# EAGLE schematic IRIS (EAGLE 6.1)
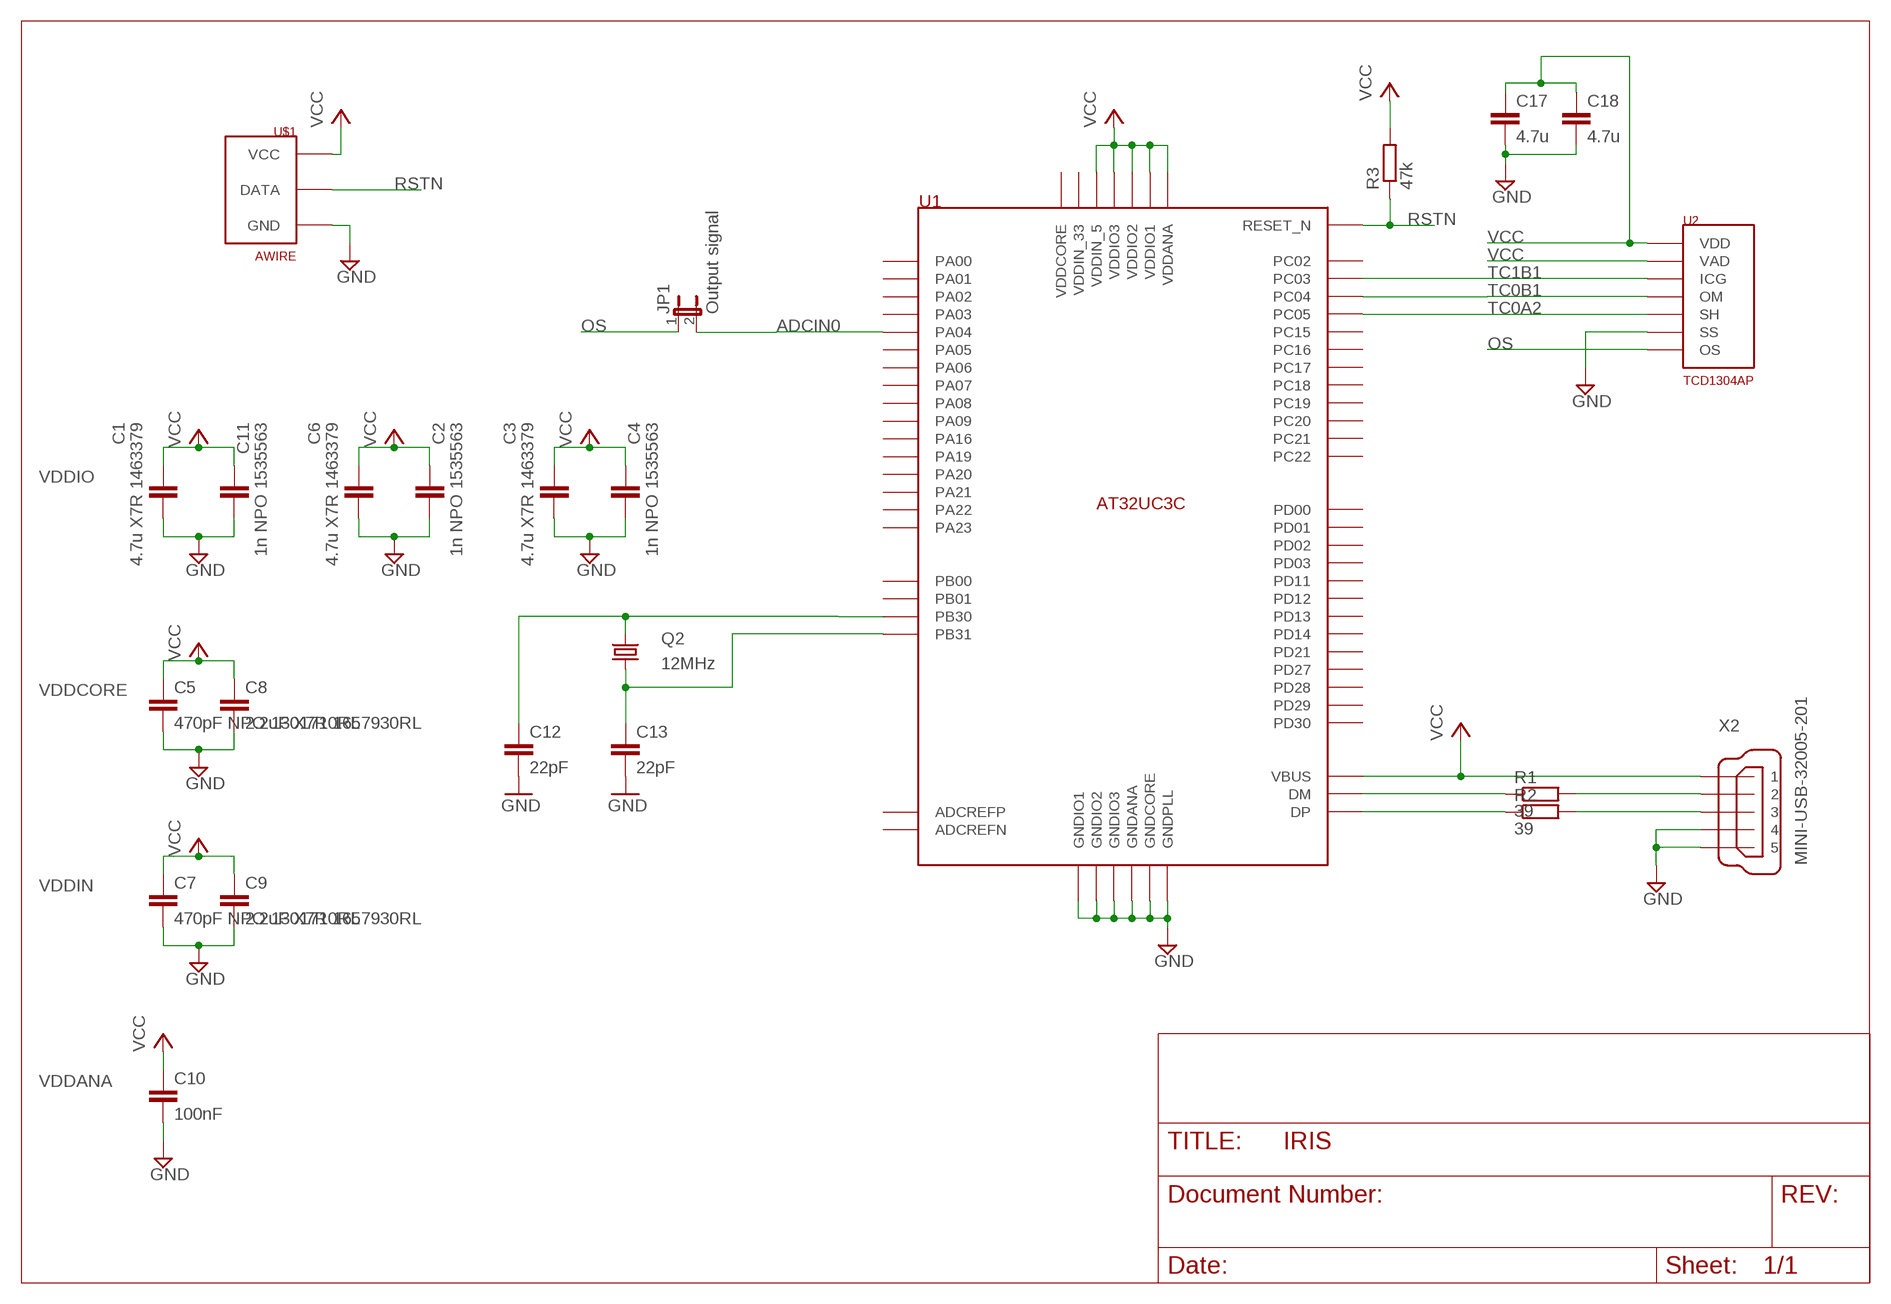
[diagram p0: schematic, sheet 1]

## Parts
C1  4.7u X7R 1463379  C-EUC0603  [C0603]
C2  1n NPO 1535563  C-EUC0402  [C0402]
C3  4.7u X7R 1463379  C-EUC0603  [C0603]
C4  1n NPO 1535563  C-EUC0402  [C0402]
C5  470pF NPO 1301710RL  C-EUC0603  [C0603]
C6  4.7u X7R 1463379  C-EUC0603  [C0603]
C7  470pF NPO 1301710RL  C-EUC0603  [C0603]
C8  2.2uF X7R 1657930RL  C-EUC0603  [C0603]
C9  2.2uF X7R 1657930RL  C-EUC0603  [C0603]
C10  100nF  C-EUC0603  [C0603]
C11  1n NPO 1535563  C-EUC0402  [C0402]
C12  22pF  C-EUC0402  [C0402]
C13  22pF  C-EUC0402  [C0402]
C17  4.7u  C-EUC0805  [C0805]
C18  4.7u  C-EUC0805  [C0805]
JP1  Output signal  JP1E  [JP1]
Q2  12MHz  CRYSTAL5X3  [CRYSTAL-SMD-5X3]
R1  39  R-EU_R0603  [R0603]
R2  39  R-EU_R0603  [R0603]
R3  47k  R-EU_R0603  [R0603]
U1  AT32UC3C  [TQFP64]
U2  TCD1304AP  [TCD1304AP]
U$1  AWIRE  [AWIRE]
X2  MINI-USB-32005-201  [32005-201]

## Nets
ADCIN0: JP1.2 U1.P$7(PA04)
GND: C1.2 C2.2 C3.2 C4.2 C5.2 C6.2 C7.2 C8.2 C9.2 C10.2 C11.2 C12.2 C13.2 C17.2 C18.2 U1.P$6(GNDIO1) U1.P$17(GNDANA) U1.P$26(GNDPLL) U1.P$30(GNDCORE) U1.P$36(GNDIO2) U1.P$52(GNDIO3) U2.P$22(SS) U$1.P$3(GND) X2.4 X2.5
N$1: R1.1 U1.P$24(DM)
N$2: R2.1 U1.P$25(DP)
N$3: R1.2 X2.2
N$4: R2.2 X2.3
N$21: C12.1 Q2.3 U1.P$31(PB30)
N$22: C13.1 Q2.1 U1.P$32(PB31)
OS: JP1.1 U2.P$21(OS)
RSTN: R3.1 U1.P$64(RESET_N) U$1.P$2(DATA)
TC0A2: U1.P$38(PC05) U2.P$5(SH)
TC0B1: U1.P$37(PC04) U2.P$4(OM)
TC1B1: U1.P$34(PC03) U2.P$3(ICG)
VCC: C1.1 C2.1 C3.1 C4.1 C5.1 C6.1 C7.1 C8.1 C9.1 C10.1 C11.1 C17.1 C18.1 R3.2 U1.P$5(VDDIO1) U1.P$18(VDDANA) U1.P$23(VBUS) U1.P$27(VDDIN_5) U1.P$35(VDDIO2) U1.P$51(VDDIO3) U2.P$1(VDD) U2.P$2(VAD) U$1.P$1(VCC) X2.1
Unconnected: U1.P$1(PA00) U1.P$2(PA01) U1.P$3(PA02) U1.P$4(PA03) U1.P$8(PA05) U1.P$9(PA06) U1.P$10(PA07) U1.P$11(PA08) U1.P$12(PA09) U1.P$13(PA16) U1.P$14(ADCREFP) U1.P$15(ADCREFN) U1.P$16(PA19) U1.P$19(PA20) U1.P$20(PA21) U1.P$21(PA22) U1.P$22(PA23) U1.P$28(VDDIN_33) U1.P$29(VDDCORE) U1.P$33(PC02) U1.P$39(PC15) U1.P$40(PC16) U1.P$41(PC17) U1.P$42(PC18) U1.P$43(PC19) U1.P$44(PC20) U1.P$45(PC21) U1.P$46(PC22) U1.P$47(PD00) U1.P$48(PD01) U1.P$49(PD02) U1.P$50(PD03) U1.P$53(PD11) U1.P$54(PD12) U1.P$55(PD13) U1.P$56(PD14) U1.P$57(PD21) U1.P$58(PD27) U1.P$59(PD28) U1.P$60(PD29) U1.P$61(PD30) U1.P$62(PB00) U1.P$63(PB01)

## Notes on the sheet
- VDDIO
- VDDCORE
- VDDIN
- VDDANA

## Library data of the parts
C1-C13 = rcl:C-EU: CAPACITOR, European symbol
C17 C18 = resistor:C-EU: CAPACITOR, European symbol
JP1 = jumper:JP1E: JUMPER
Q2 = Forrequi:CRYSTAL: Crystals Various standard crystals. Proven footprints. Spark Fun Electronics SKU : COM-00534
R1-R3 = rcl:R-EU_: RESISTOR, European symbol
U1 = IRIS:AT32UC3C
U2 = IRIS:TCD1304AP
U$1 = IRIS:AWIRE
X2 = con-cypressindustries:MINI-USB-: MINI USB-B Conector Source: www.cypressindustries.com; OC_FARNELL: unknown; OC_NEWARK: unknown